# EAGLE design untitled (EAGLE 5.06)
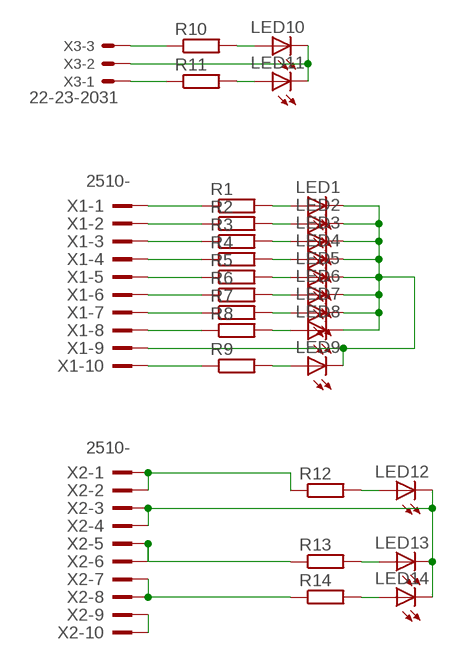
[diagram p0: schematic, sheet 1]

## Parts
LED1  LEDSFH482  [SFH482]
LED2  LEDSFH482  [SFH482]
LED3  LEDSFH482  [SFH482]
LED4  LEDSFH482  [SFH482]
LED5  LEDSFH482  [SFH482]
LED6  LEDSFH482  [SFH482]
LED7  LEDSFH482  [SFH482]
LED8  LEDSFH482  [SFH482]
LED9  LEDSFH482  [SFH482]
LED10  LEDSFH482  [SFH482]
LED11  LEDSFH482  [SFH482]
LED12  LEDSFH482  [SFH482]
LED13  LEDSFH482  [SFH482]
LED14  LEDSFH482  [SFH482]
R1  R-EU_0207/10  [0207/10]
R2  R-EU_0207/10  [0207/10]
R3  R-EU_0207/10  [0207/10]
R4  R-EU_0207/10  [0207/10]
R5  R-EU_0207/10  [0207/10]
R6  R-EU_0207/10  [0207/10]
R7  R-EU_0207/10  [0207/10]
R8  R-EU_0207/10  [0207/10]
R9  R-EU_0207/10  [0207/10]
R10  R-EU_0207/10  [0207/10]
R11  R-EU_0207/10  [0207/10]
R12  R-EU_0207/10  [0207/10]
R13  R-EU_0207/10  [0207/10]
R14  R-EU_0207/10  [0207/10]
X1  2510-  [PAK100/2500-10]
X2  2510-  [PAK100/2500-10]
X3  22-23-2031  [22-23-2031]

## Nets
N$1: R1.1 X1.1
N$2: R2.1 X1.2
N$3: R3.1 X1.3
N$4: R4.1 X1.4
N$5: R5.1 X1.5
N$6: R6.1 X1.6
N$7: R7.1 X1.7
N$8: R8.1 X1.8
N$9: LED1.A R1.2
N$10: LED2.A R2.2
N$11: LED3.A R3.2
N$12: LED4.A R4.2
N$13: LED5.A R5.2
N$14: LED6.A R6.2
N$15: LED7.A R7.2
N$16: LED8.A R8.2
N$17: R11.1 X3.1
N$18: R10.1 X3.3
N$19: LED10.A R10.2
N$20: R9.1 X1.10
N$21: LED1.K(C) LED2.K(C) LED3.K(C) LED4.K(C) LED5.K(C) LED6.K(C) LED7.K(C) LED8.K(C) LED9.K(C) X1.9
N$22: LED9.A R9.2
N$23: LED11.A R11.2
N$24: LED10.K(C) LED11.K(C) X3.2
N$25: R12.1 X2.1 X2.2
N$26: LED12.K(C) LED13.K(C) LED14.K(C) X2.3 X2.4
N$27: R13.1 X2.5 X2.6
N$28: R14.1 X2.7 X2.8
N$29: X2.9 X2.10
N$30: LED12.A R12.2
N$31: LED13.A R13.2
N$32: LED14.A R14.2

## Library data of the parts
LED1-LED14 = led:LED: LED OSRAM: - CHIPLED LG R971, LG N971, LY N971, LG Q971, LY Q971, LO R971, LY R971 LH N974, LH R974 LS Q976, LO Q976, LY Q976 LO Q996 - Hyper CHIPLED LW Q18S LB Q993, LB Q99A, LB R99A - SideLED LS A670, LO A670, LY A670, LG A670, LP A670 LB A673, LV A673, LT A673, LW A673 LH A674 LY A675 LS A676, LA A676, LO A676, LY A676, LW A676 LS A679, LY A679, LG A679 - Hyper Micro SIDELED® LS Y876, LA Y876, LO Y876, LY Y876 LT Y87S - SmartLED LW L88C, LW L88S LB L89C, LB L89S, LG L890 LS L89K, LO L89K, LY L89K LS L896, LA L896, LO L896, LY L896 - TOPLED LS T670, LO T670, LY T670, LG T670, LP T670 LSG T670, LSP T670, LSY T670, LOP T670, LYG T670 LG T671, LOG T671, LSG T671 LB T673, LV T673, LT T673, LW T673 LH T674 LS T676, LA T676, LO T676, LY T676, LB T676, LH T676, LSB T676, LW T676 LB T67C, LV T67C, LT T67C, LS T67K, LO T67K, LY T67K, LW E67C LS E67B, LA E67B, LO E67B, LY E67B, LB E67C, LV E67C, LT E67C LW T67C LS T679, LY T679, LG T679 LS T770, LO T770, LY T770, LG T770, LP T770 LB T773, LV T773, LT T773, LW T773 LH T774 LS E675, LA E675, LY E675, LS T675 LS T776, LA T776, LO T776, LY T776, LB T776 LHGB T686 LT T68C, LB T68C - Hyper Mini TOPLED® LB M676 - Mini TOPLED Santana® LG M470 LS M47K, LO M47K, LY M47K Source: http://www.osram.convergy.de LUXEON: - LUMILED® LXK2-PW12-R00, LXK2-PW12-S00, LXK2-PW14-U00, LXK2-PW14-V00 LXK2-PM12-R00, LXK2-PM12-S00, LXK2-PM14-U00 LXK2-PE12-Q00, LXK2-PE12-R00, LXK2-PE12-S00, LXK2-PE14-T00, LXK2-PE14-U00 LXK2-PB12-K00, LXK2-PB12-L00, LXK2-PB12-M00, LXK2-PB14-N00, LXK2-PB14-P00, LXK2-PB14-Q00 LXK2-PR12-L00, LXK2-PR12-M00, LXK2-PR14-Q00, LXK2-PR14-R00 LXK2-PD12-Q00, LXK2-PD12-R00, LXK2-PD12-S00 LXK2-PH12-R00, LXK2-PH12-S00 LXK2-PL12-P00, LXK2-PL12-Q00, LXK2-PL12-R00 Source: www.luxeon.com KINGBRIGHT: KA-3528ASYC Source: www.kingbright.com
R1-R14 = rcl:R-EU_: RESISTOR, European symbol
X1 X2 = con-3m:2510-: 3M (TM) Pak 100 4-Wall Header Source: 3M
X3 = con-molex:22-23-2031: .100" (2.54mm) Center Header - 3 Pin

## Board
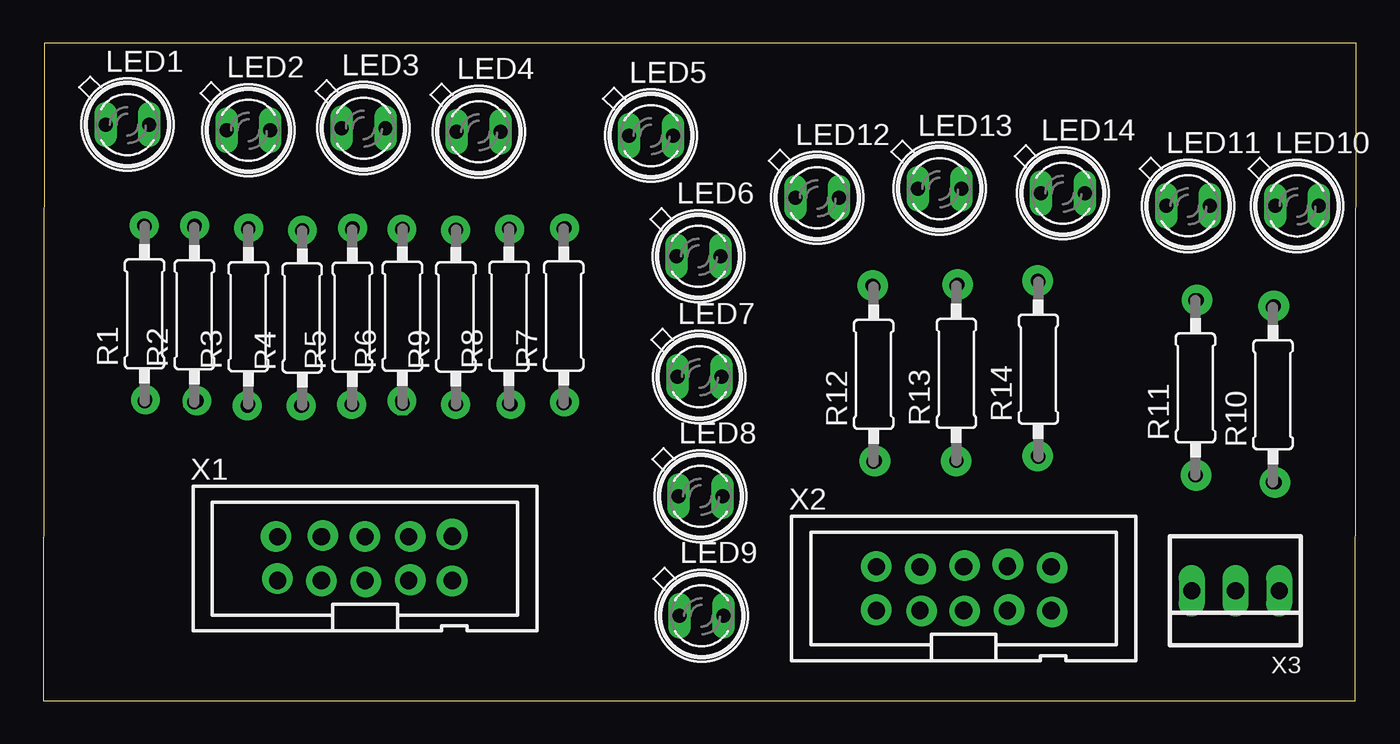
[diagram p1: board, top side]
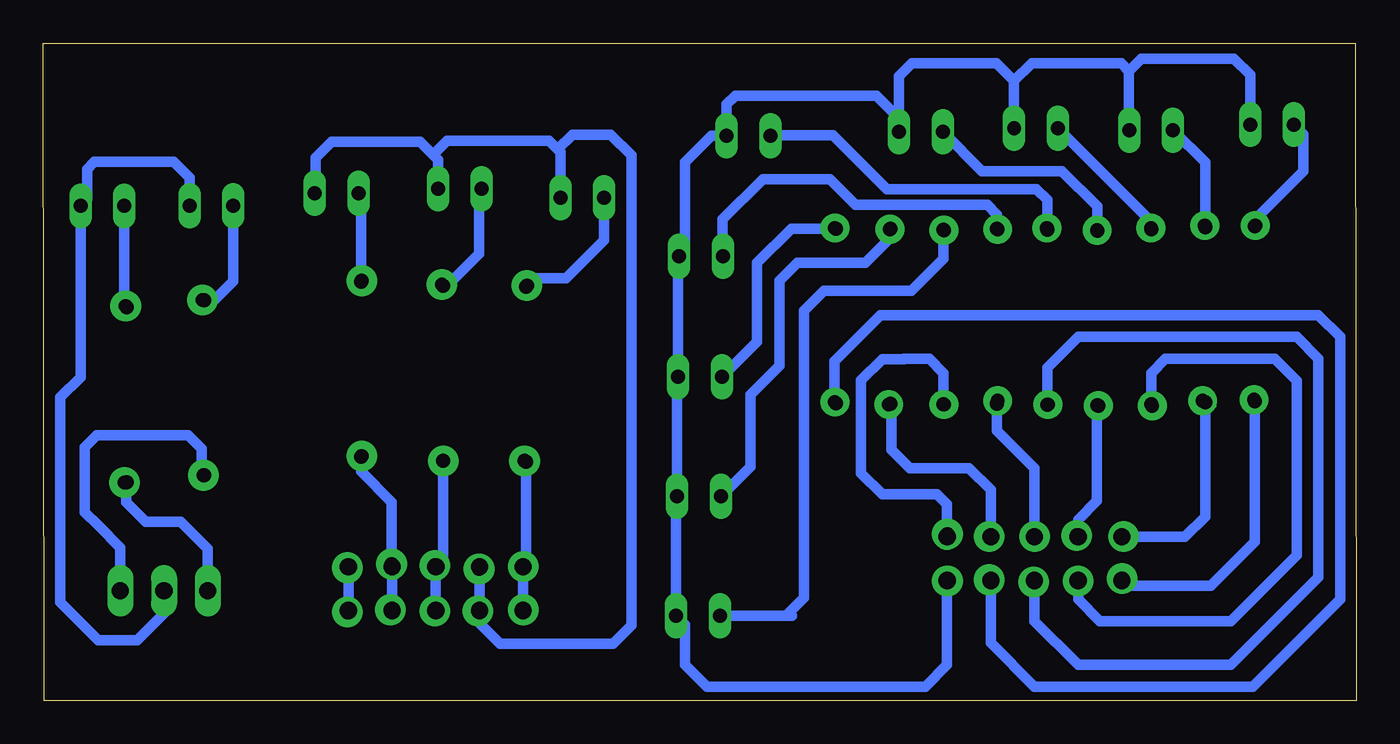
[diagram p2: board, bottom side, seen from below]

Size 76.38 x 38.22 mm. Coordinates in mm from the lower left corner, seen from the top.
Outline: 0,0 76.31,0 76.38,38.22 0.07,38.22 0,0
Copper layers (1*16): Top 0.035mm / dielectric 1.5mm / Bottom 0.035mm
Design rules "default": minimum track width 10mil, minimum drill 24mil, track to track 8mil, track to pad 8mil, pad to pad 8mil, via to via 8mil, smd to smd 8mil, copper to edge 40mil, drill to drill 8mil, minimum pad ring 10mil, minimum via ring 8mil, stop-mask expansion 4mil, vias tented up to drill 0mil, thermal gap 10mil

### Footprints (pad centres in the part's own frame; a part is rotated, then mirrored left to right if it is on the bottom)
SFH482 = drill 0.813 long: A -1.27,0; K 1.27,0
0207/10 = drill 0.813 octagon: 1 -5.08,0; 2 5.08,0
PAK100/2500-10 = drill 1 pad 1.422 round: 1 -5.08,-1.27; 2 -5.08,1.27; 3 -2.54,-1.27; 4 -2.54,1.27; 5 0,-1.27; 6 0,1.27; 7 2.54,-1.27; 8 2.54,1.27; 9 5.08,-1.27; 10 5.08,1.27
22-23-2031 = drill 1 long: 1 -2.54,0; 2 0,0; 3 2.54,0

### Placement (x,y rotation side)
LED1  4.91,33.48 0 top
LED2  11.95,33.16 0 top
LED3  18.64,33.27 0 top
LED4  25.33,33.07 0 top
LED5  35.36,32.84 0 top
LED6  38.11,25.83 0 top
LED7  38.17,18.82 0 top
LED8  38.24,11.88 0 top
LED9  38.29,4.93 0 top
LED10  72.92,28.75 0 top
LED11  66.58,28.76 0 top
LED12  45.02,29.23 0 top
LED13  52.14,29.76 0 top
LED14  59.3,29.49 0 top
R1  5.9,22.48 90 top
R2  8.8,22.43 90 top
R3  11.94,22.31 90 top
R4  15.07,22.24 90 top
R5  17.98,22.29 90 top
R6  20.9,22.34 90 top
R7  30.28,22.36 90 top
R8  27.1,22.34 90 top
R9  24.01,22.3 90 top
R10  71.52,17.78 90 top
R11  67.01,18.18 90 top
R12  48.3,18.96 90 top
R13  53.11,19.02 90 top
R14  57.88,19.27 90 top
X1  18.73,8.25 0 top
X2  53.54,6.51 0 top
X3  69.34,6.38 180 top

### Tracks (layer width: path | path; a pad name or v marks a point on that pad's centre or on a via)
N$1
  Bottom 0.61: R1.1 5.9,9.24 8.48,6.66 13.33,6.66 X1.1
N$2
  Bottom 0.61: X1.2 9.98,9.52 8.8,10.69 R2.1
N$3
  Bottom 0.61: R3.1 11.94,19.03 11.11,19.87 4.76,19.87 3.49,18.6 3.49,8.44 7.3,4.63 14.92,4.63 16.19,5.9 X1.3
N$4
  Bottom 0.61: X1.4 16.19,10.52 15.11,11.6 15.11,17.12 R4.1
N$5
  Bottom 0.61: R5.1 17.98,19.34 16.19,21.14 3.49,21.14 2.22,19.87 2.22,7.17 7.3,2.09 16.19,2.09 18.73,4.63 X1.5
N$6
  Bottom 0.61: R6.1 20.9,15.69 18.73,13.52 X1.6
N$7
  Bottom 0.61: X1.7 21.27,3.36 18.73,0.82 6.03,0.82 0.95,5.9 0.95,21.14 2.22,22.41 27.69,22.41 30.37,19.73 30.37,17.37 R7.1
N$8
  Bottom 0.61: X1.8 21.27,12.25 22.54,13.52 25.98,13.52 27.06,14.59 27.06,17.22 R8.1
N$9
  Bottom 0.61: R1.2 5.9,27.96 3.09,30.77 3.09,32.93 LED1.A
N$10
  Bottom 0.61: R2.2 8.8,31.28 LED2.A
N$11
  Bottom 0.61: R3.2 11.94,27.84 LED3.A
N$12
  Bottom 0.61: R4.2 15.07,28.72 17.12,30.77 21.77,30.77 LED4.A
N$13
  Bottom 0.61: R5.2 17.98,29.1 18.61,29.73 27.31,29.73 30.43,32.85 34.07,32.85 LED5.A
N$14
  Bottom 0.61: R6.2 20.9,28.25 21.47,28.82 29.13,28.82 30.63,30.32 34.52,30.32 36.86,27.98 36.86,25.85 LED6.A
N$15
  Bottom 0.61: R7.2 32.86,27.44 34.85,25.44 34.85,20.87 LED7.A
N$16
  Bottom 0.61: R8.2 27.1,26.89 28.55,25.44 32.51,25.44 33.55,24.4 33.55,19.46 35.24,17.78 35.24,13.6 LED8.A
N$17
  Bottom 0.61: X3.1 71.88,8.89 73.17,10.18 73.95,10.96 73.95,14.72 73.24,15.43 67.93,15.43 67.15,14.65 67.15,13.24 R11.1
N$18
  Bottom 0.61: X3.3 66.8,8.84 68.36,10.39 70.41,10.39 71.54,11.53 71.54,12.68 R10.1
N$19
  Bottom 0.61: LED10.A 71.65,22.99 R10.2
N$20
  Bottom 0.61: X1.10 23.81,11.4 24.39,11.99 27.58,11.99 28.81,13.23 28.81,18.62 27.58,19.86 26.32,19.86 26.31,19.87 24.83,19.87 24.01,19.04 R9.1
N$21
  Bottom 0.61: X1.9 23.81,2.09 25.08,0.82 37.78,0.82 39.05,2.09 39.05,4.41 LED9.K 39.56,11.82 LED8.K 39.5,18.75 LED7.K 39.44,25.77 LED6.K 39.05,26.16 39.05,31.3 37.5,32.84 LED5.K 36.63,34.65 36.12,35.16 27.9,35.16 26.6,33.86 | LED1.K 6.18,36.36 7.12,37.31 12.52,37.31 13.23,36.59 | 13.23,36.59 13.23,33.17 LED2.K | 19.91,36.03 LED3.K | 19.91,36.03 18.89,37.05 13.69,37.05 13.23,36.59 | 26.6,33.86 26.6,36.29 25.84,37.05 20.93,37.05 19.91,36.03 | 26.6,33.86 LED4.K
N$22
  Bottom 0.61: R9.2 24.01,25.7 25.89,23.82 30.95,23.82 32.12,22.65 32.12,5.97 33.16,4.93 | 33.16,4.93 32.82,4.93 | 33.16,4.93 LED9.A
N$23
  Bottom 0.61: R11.2 66.43,23.26 65.31,24.37 LED11.A
N$24
  Bottom 0.61: LED11.K 67.85,30.39 68.78,31.32 73.38,31.32 73.81,30.9 73.81,29.13 LED10.K 74.19,18.81 75.37,17.63 75.37,5.71 73.17,3.51 70.91,3.51 69.34,5.08 X3.2
N$25
  Bottom 0.61: X2.1 X2.2 48.3,7.94 R12.1
N$26
  Bottom 0.61: X2.3 X2.4 51,4.5 49.81,3.32 43.24,3.32 42.17,4.39 42.17,31.69 43.38,32.9 45.59,32.9 46.45,32.05 | LED13.K 53.41,31.43 53.7,31.72 | 53.7,31.72 54.45,32.47 59.6,32.47 60.53,31.55 60.53,29.54 LED14.K | LED12.K 46.29,31.88 46.45,32.05 | 46.45,32.05 46.95,32.55 52.88,32.55 53.7,31.72
N$27
  Bottom 0.61: X2.5 X2.6 53.11,8.21 R13.1
N$28
  Bottom 0.61: X2.7 X2.8 56.1,7.8 56.1,11.54 57.88,13.32 R14.1
N$29
  Bottom 0.61: X2.9 X2.10
N$30
  Bottom 0.61: LED12.A 43.75,26.75 45.95,24.54 47.8,24.54 R12.2
N$31
  Bottom 0.61: R13.2 52.89,24.1 51.02,25.97 51.02,29.6 LED13.A
N$32
  Bottom 0.61: R14.2 57.88,29.34 LED14.A
N$33  (via drill 0.8 pad 1.68)
  other vias: 5.89,27.61
N$34  (via drill 0.8 pad 1.68)
  other vias: 8.82,27.61
N$35  (via drill 0.8 pad 1.68)
  other vias: 11.95,27.47
N$36  (via drill 0.8 pad 1.68)
  other vias: 15.08,27.33
N$37  (via drill 0.8 pad 1.68)
  other vias: 18.01,27.47
N$38  (via drill 0.8 pad 1.68)
  other vias: 20.86,27.4
N$39  (via drill 0.8 pad 1.68)
  other vias: 24,27.33
N$40  (via drill 0.8 pad 1.68)
  other vias: 27.13,27.4
N$41  (via drill 0.8 pad 1.68)
  other vias: 30.34,27.47
N$42  (via drill 0.8 pad 1.68)
  other vias: 30.34,17.35
N$43  (via drill 0.8 pad 1.68)
  other vias: 27.2,17.21
N$44  (via drill 0.8 pad 1.68)
  other vias: 24,17.21
N$45  (via drill 0.8 pad 1.68)
  other vias: 20.86,17.42
N$46  (via drill 0.8 pad 1.68)
  other vias: 17.94,17.21
N$47  (via drill 0.8 pad 1.68)
  other vias: 15.01,17.14
N$48  (via drill 0.8 pad 1.68)
  other vias: 11.88,17.14
N$49  (via drill 0.8 pad 1.68)
  other vias: 8.96,17.42
N$50  (via drill 0.8 pad 1.68)
  other vias: 5.96,17.49
N$51  (via drill 0.8 pad 1.78)
  other vias: 13.55,9.54
N$52  (via drill 0.8 pad 1.78)
  other vias: 13.62,7.1
N$53  (via drill 0.8 pad 1.78)
  other vias: 16.2,6.96
N$54  (via drill 0.8 pad 1.78)
  other vias: 16.27,9.61
N$55  (via drill 0.8 pad 1.78)
  other vias: 18.71,9.54
N$56  (via drill 0.8 pad 1.78)
  other vias: 18.78,6.89
N$57  (via drill 0.8 pad 1.78)
  other vias: 21.35,7.03
N$58  (via drill 0.8 pad 1.78)
  other vias: 21.35,9.54
N$59  (via drill 0.8 pad 1.78)
  other vias: 23.79,9.68
N$60  (via drill 0.8 pad 1.78)
  other vias: 23.79,6.96
N$61  (via drill 0.8 pad 1.78)
  other vias: 48.44,7.79
N$62  (via drill 0.8 pad 1.78)
  other vias: 48.44,5.28
N$63  (via drill 0.8 pad 1.78)
  other vias: 51.09,5.21
N$64  (via drill 0.8 pad 1.78)
  other vias: 51.02,7.65
N$65  (via drill 0.8 pad 1.78)
  other vias: 53.6,7.86
N$66  (via drill 0.8 pad 1.78)
  other vias: 53.6,5.21
N$67  (via drill 0.8 pad 1.78)
  other vias: 56.18,5.28
N$68  (via drill 0.8 pad 1.78)
  other vias: 56.11,7.93
N$69  (via drill 0.8 pad 1.78)
  other vias: 58.68,7.72
N$70  (via drill 0.8 pad 1.78)
  other vias: 58.68,5.14
N$71  (via drill 0.8 pad 1.78)
  other vias: 53.18,24.19
N$72  (via drill 0.8 pad 1.78)
  other vias: 57.85,24.4
N$73  (via drill 0.8 pad 1.78)
  other vias: 57.85,14.21
N$74  (via drill 0.8 pad 1.78)
  other vias: 53.11,13.93
N$75  (via drill 0.8 pad 1.78)
  other vias: 48.37,13.93
N$76  (via drill 0.8 pad 1.78)
  other vias: 48.24,24.12
N$77  (via drill 0.8 pad 1.78)
  other vias: 67.11,23.29
N$78  (via drill 0.8 pad 1.78)
  other vias: 71.57,22.94
N$79  (via drill 0.8 pad 1.78)
  other vias: 67.04,13.1
N$80  (via drill 0.8 pad 1.78)
  other vias: 71.64,12.68